# Altium project Switch.PrjPcb
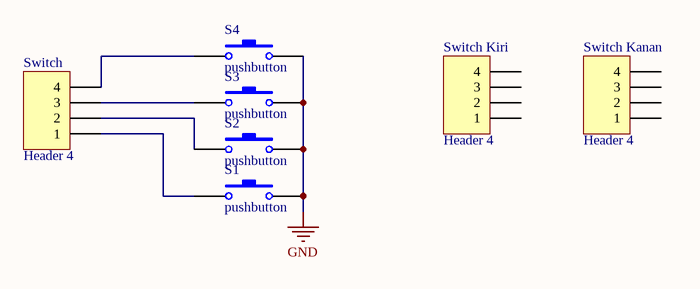
[diagram p0: Switch.SchDoc]
1 sheet, 7 parts. Net scope: global (net labels, ports and power ports of the same name join across sheets).
Board file: Switch.PcbDoc

## Sheet Switch.SchDoc
size A

### Parts
S1  pushbutton  [pushbutton]
S2  pushbutton  [pushbutton]
S3  pushbutton  [pushbutton]
S4  pushbutton  [pushbutton]
Switch  Header 4  [HDR1X4]
Switch_Kanan  Header 4  [HDR1X4]
Switch_Kiri  Header 4  [HDR1X4]

### Nets
GND: S1.2 S2.2 S3.2 S4.2
NetS1_1: S1.1 Switch.1
NetS2_1: S2.1 Switch.2
NetS3_1: S3.1 Switch.3
NetS4_1: S4.1 Switch.4

Not connected (* = marked no-connect by the designer): Switch_Kanan 1 2 3 4; Switch_Kiri 1 2 3 4

### Library data of the parts
Switch Switch_Kanan Switch_Kiri = Header 4: Header, 4-Pin; LatestRevisionDate: 17-Jul-2002; LatestRevisionNote: Re-released for DXP Platform.; Publisher: Altium Limited